# EAGLE design Ex 8x8 LED Matrix (EAGLE 7.5.0)
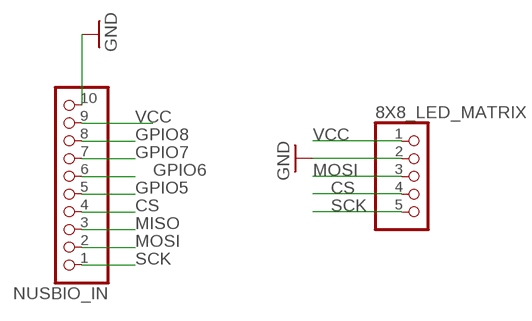
[diagram p0: schematic, sheet 1]

## Parts
8X8_LED_MATRIX  PINHD-1X5  [1X05]
NUSBIO_IN  PINHD-1X10  [1X10-BIG]

## Nets
CS: 8X8_LED_MATRIX.4 NUSBIO_IN.4
GND: 8X8_LED_MATRIX.2 NUSBIO_IN.10
GPIO5: NUSBIO_IN.5
GPIO6: NUSBIO_IN.6
GPIO7: NUSBIO_IN.7
GPIO8: NUSBIO_IN.8
MISO: NUSBIO_IN.3
MOSI: 8X8_LED_MATRIX.3 NUSBIO_IN.2
SCK: 8X8_LED_MATRIX.5 NUSBIO_IN.1
VCC: 8X8_LED_MATRIX.1 NUSBIO_IN.9

## Library data of the parts
8X8_LED_MATRIX = pinhead:PINHD-1X5: PIN HEADER
NUSBIO_IN = adafruit:PINHD-1X10: Pin header 1x10 0.1" spacing With round pins

## Board
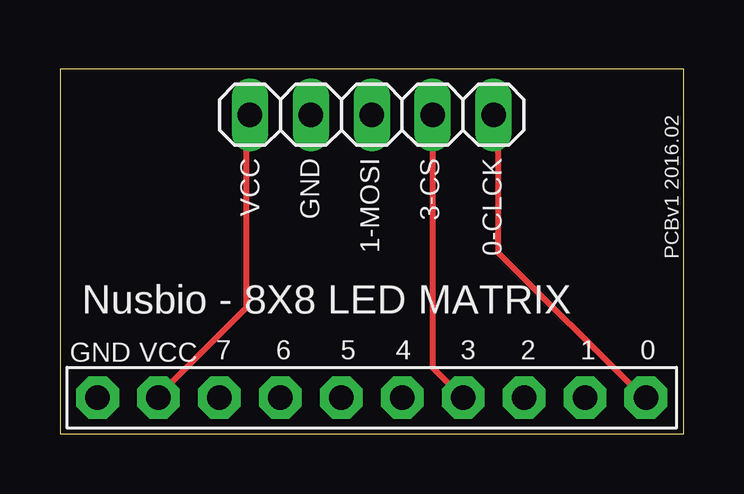
[diagram p1: board, top side]
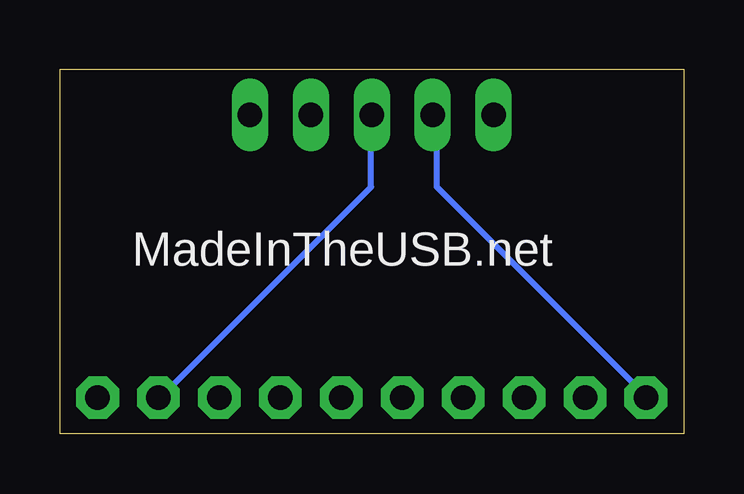
[diagram p2: board, bottom side, seen from below]

Size 26 x 15.2 mm. Coordinates in mm from the lower left corner, seen from the top.
Outline: 0,0 26,0 26,15.2 0,15.2 0,0
Copper layers (1*16): Top 0.035mm / dielectric 1.5mm / Bottom 0.035mm
Design rules "default": minimum track width 10mil, minimum drill 24mil, track to track 8mil, track to pad 8mil, pad to pad 8mil, via to via 8mil, smd to smd 8mil, copper to edge 40mil, drill to drill 8mil, minimum pad ring 10mil, minimum via ring 8mil, stop-mask expansion 4mil, vias tented up to drill 0mil, thermal gap 10mil

### Footprints (pad centres in the part's own frame; a part is rotated, then mirrored left to right if it is on the bottom)
1X05 = drill 1.016 long: 1 -5.08,0; 2 -2.54,0; 3 0,0; 4 2.54,0; 5 5.08,0
1X10-BIG = drill 1.016 pad 1.778 octagon: 1 -11.43,0; 2 -8.89,0; 3 -6.35,0; 4 -3.81,0; 5 -1.27,0; 6 1.27,0; 7 3.81,0; 8 6.35,0; 9 8.89,0; 10 11.43,0

### Placement (x,y rotation side)
8X8_LED_MATRIX  13,13.3 0 top
NUSBIO_IN  13,1.5 180 top

### Tracks (layer width: path | path; a pad name or v marks a point on that pad's centre or on a via)
CS
  Top 0.254: 8X8_LED_MATRIX.4 15.54,13.26 15.54,2.74 16.69,1.6 NUSBIO_IN.4
GND
  Bottom 0.254: 8X8_LED_MATRIX.2 10.29,13.26 10.29,10.29 1.6,1.6 NUSBIO_IN.10
MOSI
  Bottom 0.254: 8X8_LED_MATRIX.3 13.03,13.26 13.03,10.29 21.72,1.6 NUSBIO_IN.2
SCK
  Top 0.254: 8X8_LED_MATRIX.5 18.29,13.26 18.29,7.54 24.23,1.6 NUSBIO_IN.1
VCC
  Top 0.254: 8X8_LED_MATRIX.1 7.77,13.26 7.77,5.26 4.12,1.6 NUSBIO_IN.9

### Text on the board
tNames: VCC | GND | 1-MOSI | 3-CS | 0-CLCK | PCBv1 2016.02 | Nusbio - 8X8 LED MATRIX | GND | VCC | 7 | 6 | 5 | 4 | 3 | 2 | 1 | 0
bNames: MadeInTheUSB.net